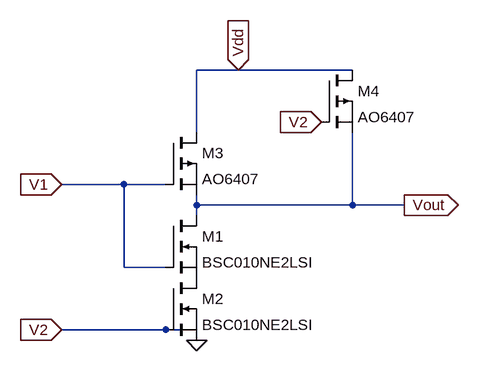
[diagram p0: schematic mynand.asc]
mynand.asc, the LTspice schematic file:
Version 4
SHEET 1 880 680
WIRE 208 -80 144 -80
WIRE 384 -80 208 -80
WIRE 144 16 144 -80
WIRE 32 96 -64 96
WIRE 96 96 32 96
WIRE 144 128 144 112
WIRE 384 128 384 16
WIRE 384 128 144 128
WIRE 464 128 384 128
WIRE 144 144 144 128
WIRE 32 224 32 96
WIRE 96 224 32 224
WIRE 96 320 -64 320
WIRE 144 320 96 320
FLAG -64 96 V1
IOPIN -64 96 In
FLAG -64 320 V2
IOPIN -64 320 In
FLAG 208 -80 Vdd
IOPIN 208 -80 In
FLAG 464 128 Vout
IOPIN 464 128 Out
FLAG 144 336 0
FLAG 336 0 V2
IOPIN 336 0 In
SYMBOL nmos 96 144 R0
SYMATTR InstName M1
SYMATTR Value BSC010NE2LSI
SYMBOL nmos 96 240 R0
SYMATTR InstName M2
SYMATTR Value BSC010NE2LSI
SYMBOL pmos 96 16 R0
SYMATTR InstName M3
SYMATTR Value AO6407
SYMBOL pmos 336 -80 R0
SYMATTR InstName M4
SYMATTR Value AO6407

The netlist it stands for:
* mynand.asc
M1 Vout V1 P001 P001 BSC010NE2LSI
M2 P001 V2 0 0 BSC010NE2LSI
M3 Vdd V1 Vout Vout AO6407
M4 Vdd V2 Vout Vout AO6407
.model NMOS NMOS
.model PMOS PMOS
.lib standard.mos
.backanno
.end